# EAGLE design SchranklichtV3 (EAGLE 9.6.2)
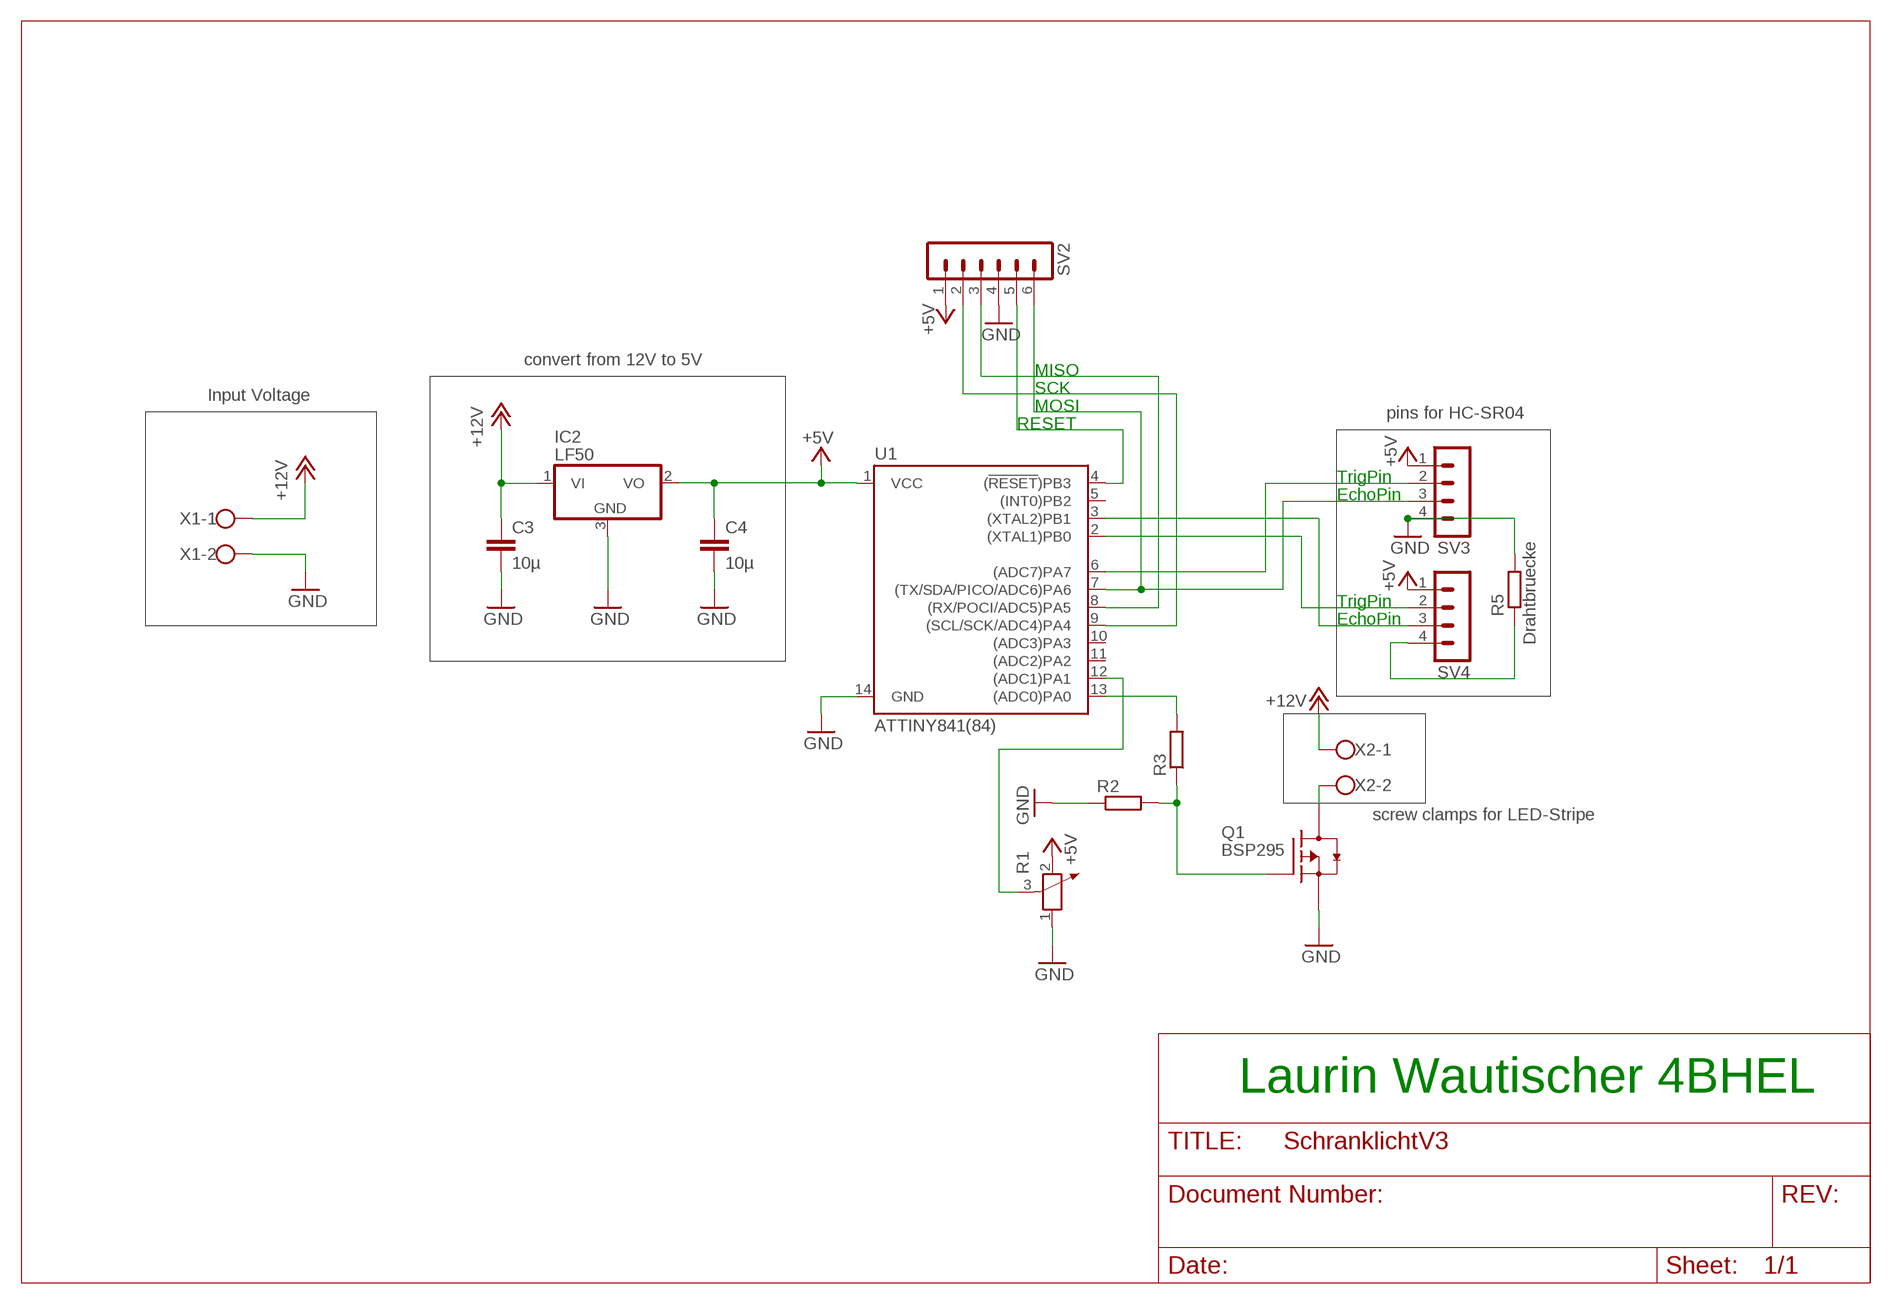
[diagram p0: schematic, sheet 1]

## Parts
C3  10µ  C-EUC1210  [C1210]
C4  10µ  C-EUC1210  [C1210]
IC2  LF50  7805DT  [TO252]
Q1  BSP295  MOSFET-PCH_SOT-223  [SOT230P700X160-4N]
R1  POTENTIOMETER_PT-10  [PT-10]
R2  R-EU_0207/10  [0207/10]
R3  R-EU_0207/10  [0207/10]
R5  Drahtbruecke  R-EU_0207/7  [0207/7]
SV2  MA06-1  [MA06-1]
SV3  MA04-1  [MA04-1]
SV4  MA04-1  [MA04-1]
U1  ATTINY841(84)  ATTINY84  [SO14]
X1  W237-102  [W237-102]
X2  W237-102  [W237-102]

## Nets
+5V: C4.1 IC2.2(VO) R1.2 SV2.1 SV3.1 SV4.1 U1.1(VCC)
+12V: C3.1 IC2.1(VI) X1.1 X2.1
GND: C3.2 C4.2 IC2.3(GND) Q1.3(S) R1.1 R2.1 R5.2 SV2.4 SV3.4 U1.14(GND) X1.2
N$1: SV2.5 U1.4((!RESET!)PB3)
N$2: SV2.6 SV3.3 U1.7((TX/SDA/PICO/ADC6)PA6)
N$3: SV3.2 U1.6((ADC7)PA7)
N$4: SV4.3 U1.3((XTAL2)PB1)
N$5: SV4.2 U1.2((XTAL1)PB0)
N$6: R1.3 U1.12((ADC1)PA1)
N$7: R3.2 U1.13((ADC0)PA0)
N$8: Q1.4(D) X2.2
N$9: Q1.1(G) R2.2 R3.1
N$10: R5.1 SV4.4
N$11: SV2.2 U1.9((SCL/SCK/ADC4)PA4)
N$12: SV2.3 U1.8((RX/POCI/ADC5)PA5)
Unconnected: U1.5((INT0)PB2) U1.10((ADC3)PA3) U1.11((ADC2)PA2)

## Notes on the sheet
- convert from 12V to 5V
- MISO
- SCK
- Input Voltage
- MOSI
- pins for HC-SR04
- RESET
- TrigPin
- EchoPin
- TrigPin
- EchoPin
- screw clamps for LED-Stripe
- Laurin Wautischer 4BHEL

## Library data of the parts
C3 C4 = rcl:C-EU: CAPACITOR, European symbol; SPICEPREFIX: C
IC2 = linear:78*: Positive VOLTAGE REGULATOR Source: http://cache.national.com/ds/LM/LM78L05.pdf http://www.fairchildsemi.com/ds/LM/LM7805.pdf; SPICEPREFIX: J
Q1 = ipc-7351-transistor:MOSFET-PCH_
R1 = rcl:POTENTIOMETER_: Potentiometer; SPICEMODEL: POT; SPICEPREFIX: X
R2 R3 R5 = rcl:R-EU_: RESISTOR, European symbol; SPICEPREFIX: R
SV2 = con-lstb:MA06-1: PIN HEADER; OC_FARNELL: unknown; OC_NEWARK: unknown
SV3 SV4 = con-lstb:MA04-1: PIN HEADER; OC_FARNELL: unknown; OC_NEWARK: unknown
U1 = SparkFun-IC-Microcontroller:ATTINY84: Atmel 14-pin 2/4/8kB flash uC Datasheet <https://cdn.sparkfun.com/datasheets/Widgets/doc8006.pdf> SparkFun Products Tiny AVR Programmer <https://www.sparkfun.com/products/11801> (PGM-11801) SparkFun Servo Trigger - Continuous Rotation <https://www.sparkfun.com/products/13872> (WIG-13872) SparkFun Servo Trigger <https://www.sparkfun.com/products/13118> (WIG-13118); PROD_ID: IC-11285; VALUE: ATTINY84
X1 X2 = con-wago-500:W237-102: WAGO SCREW CLAMP; MPN: 237-102; OC_FARNELL: unknown; OC_NEWARK: 70K9898

## Board
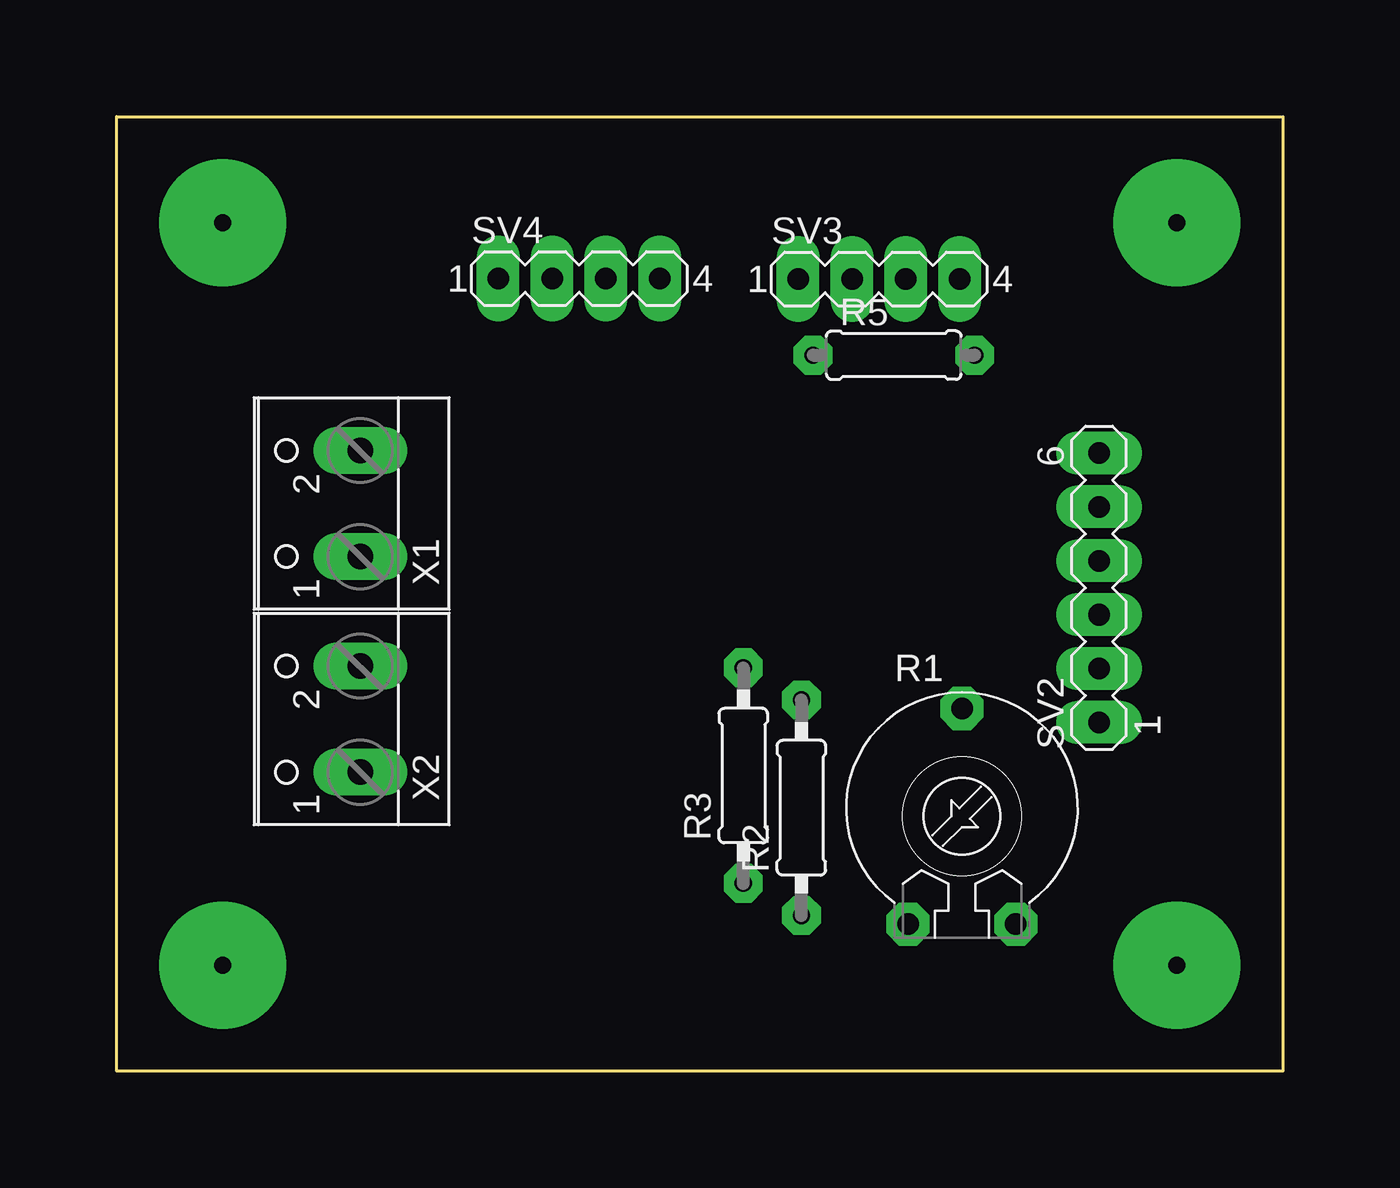
[diagram p1: board, top side]
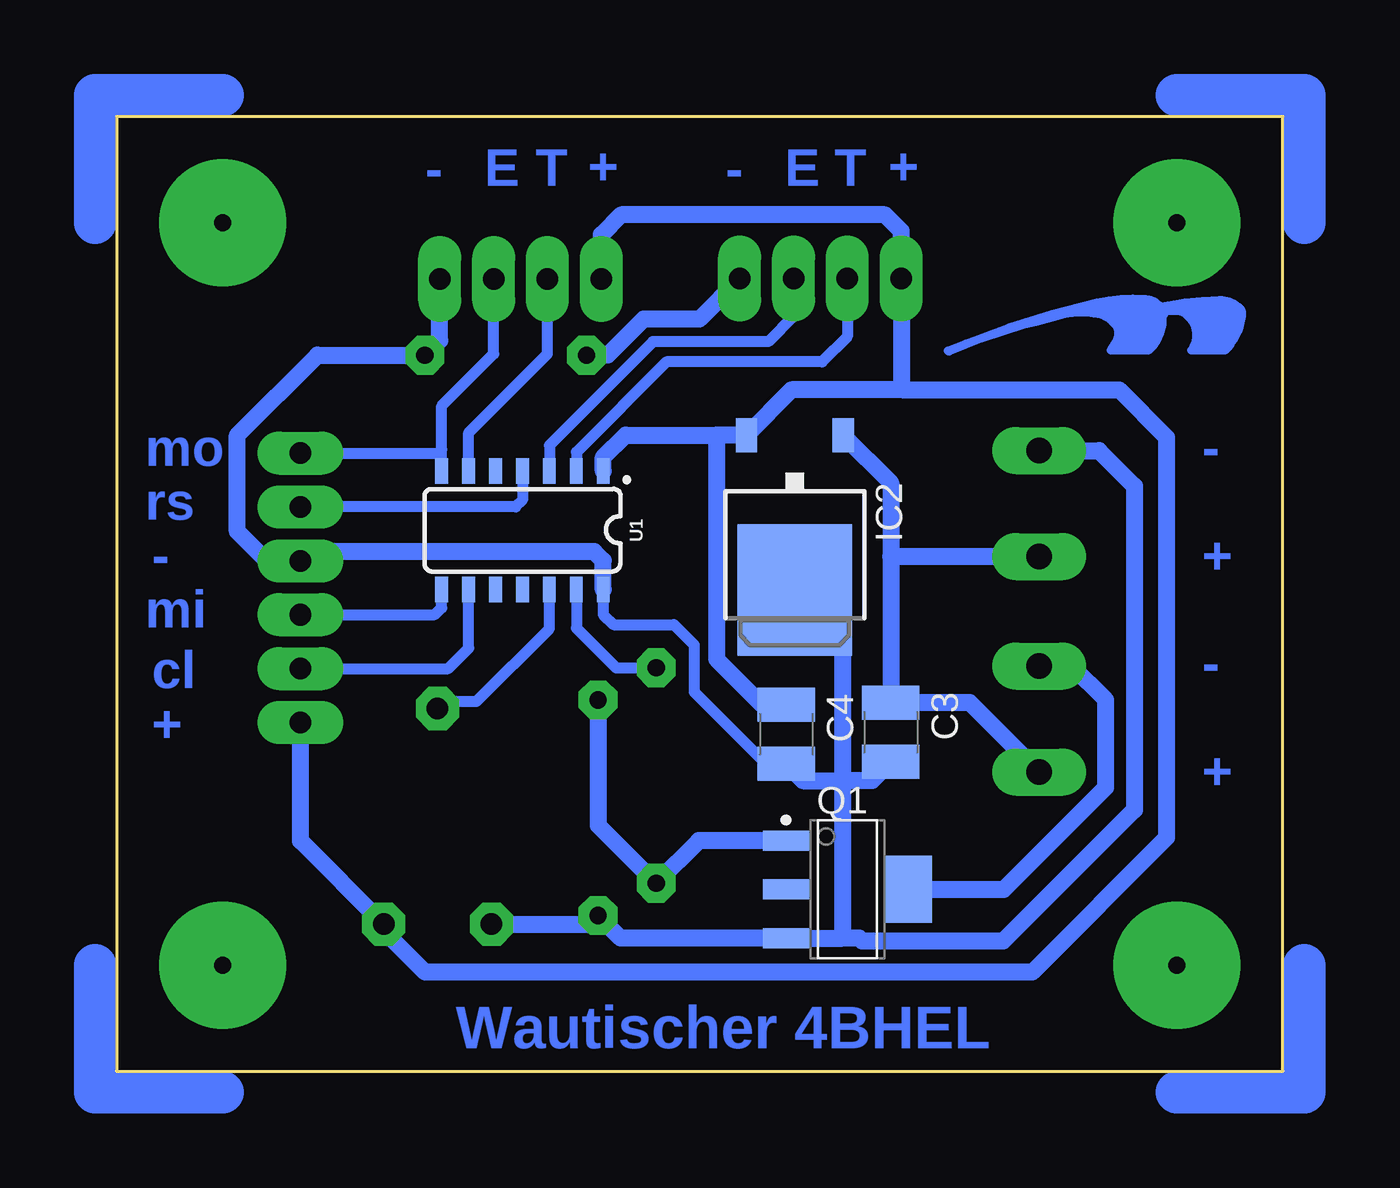
[diagram p2: board, bottom side, seen from below]

Size 55 x 45 mm. Coordinates in mm from the lower left corner, seen from the top.
Outline: 0,0 0,45 55,45 55,0 0,0
Copper layers (1*16): Top 0.035mm / dielectric 1.5mm / Bottom 0.035mm
Design rules "HTL-KLU-DRC *": minimum track width 16mil, minimum drill 31mil, track to track 16mil, track to pad 16mil, pad to pad 16mil, via to via 16mil, smd to smd 12mil, copper to edge 40mil, drill to drill 16mil, minimum pad ring 20mil, minimum via ring 16mil, stop-mask expansion 4mil, vias tented up to drill 0mil, thermal gap 20mil

### Footprints (pad centres in the part's own frame; a part is rotated, then mirrored left to right if it is on the bottom)
C1210 = smd 1.6 x 2.7: 1 -1.4,0; 2 1.4,0
TO252 = smd 1 x 1.6: 1 -2.28,-4.8; 2 2.28,-4.8 | smd 5.4 x 6.2: 3 0,2.5
SOT230P700X160-4N = smd 2.15 x 0.95: 1 -2.9,2.3; 2 -2.9,0; 3 -2.9,-2.3 | smd 2.15 x 3.15: 4 2.9,0
PT-10 = drill 1.016 pad 1.778 octagon: 1 -2.54,-5.08; 2 2.54,-5.08; 3 0,5.08
0207/10 = drill 0.813 octagon: 1 -5.08,0; 2 5.08,0
0207/7 = drill 0.813 octagon: 1 -3.81,0; 2 3.81,0
MA06-1 = drill 1.016 long: 1 -6.35,0; 2 -3.81,0; 3 -1.27,0; 4 1.27,0; 5 3.81,0; 6 6.35,0
MA04-1 = drill 1.016 long: 1 -3.81,0; 2 -1.27,0; 3 1.27,0; 4 3.81,0
SO14 = smd 0.6 x 1.2: 1 -3.81,-2.8; 2 -2.54,-2.8; 3 -1.27,-2.8; 4 0,-2.8; 5 1.27,-2.8; 6 2.54,-2.8; 7 3.81,-2.8; 8 3.81,2.8; 9 2.54,2.8; 10 1.27,2.8; 11 0,2.8; 12 -1.27,2.8; 13 -2.54,2.8; 14 -3.81,2.8
W237-102 = drill 1.194 long: 1 -2.5,-1.27; 2 2.5,-1.27

### Placement (x,y rotation side)
C3  18.49,15.98 270 bottom
C4  23.43,15.88 270 bottom
IC2  23.02,25.19 180 bottom
Q1  20.54,8.57 0 bottom
R1  39.87,12.02 0 top
R2  32.3,12.42 90 top
R3  29.55,13.94 90 top
R5  36.65,33.76 0 top
SV2  46.33,22.79 90 top
SV3  35.95,37.34 0 top
SV4  21.81,37.36 0 top
U1  35.86,25.5 180 bottom
U$1  [LOGOBOT_15]  7,34 0 top
X1  10.22,26.76 90 top
X2  10.22,16.6 90 top

### Tracks (layer width: path | path; a pad name or v marks a point on that pad's centre or on a via)
+5V
  Bottom 0.813: 17.88,32.12 23.18,32.12 IC2.2 26.7,29.99 | 17.88,32.12 7.71,32.12 5.49,29.89 5.49,11.01 11.82,4.67 40.45,4.67 42.41,6.62 R1.2 46.33,10.86 SV2.1 | SV3.1 32.14,39.44 31.21,40.37 18.76,40.37 18,39.61 SV4.1 18,32.24 17.88,32.12 | 26.7,29.99 26.7,19.42 24.56,17.29 C4.1 | 26.7,29.99 31,29.99 32.05,28.93 U1.1
+12V
  Bottom 0.813: X2.1 14.77,17.38 C3.1 18.49,24.26 | X1.1 18.49,24.26 | IC2.1 18.49,27.74 18.49,24.26
GND
  Bottom 0.508: U1.14 32.05,21.52 31.57,21.05 28.72,21.05 27.77,20.1 27.77,17.88 24.38,14.48 C4.2
  Bottom 0.813: R1.1 32.7,6.94 R2.1 31.23,6.27 Q1.3 20.78,6.27 | IC2.3 20.78,20.45 20.78,13.7 | 20.78,13.7 20.78,6.27 | C3.2 19.37,13.7 20.78,13.7 | C4.2 22.64,13.7 20.78,13.7 | U1.14 32.05,24.07 32.48,24.5 45.9,24.5 SV2.4 47.92,24.06 49.3,25.45 49.3,29.98 45.53,33.76 R5.2 39.76,34.45 SV3.4 | X1.2 8.67,29.26 6.99,27.58 6.99,12.33 13.18,6.14 19.84,6.14 19.97,6.27 20.78,6.27
N$1
  Bottom 0.508: U1.4 35.86,26.93 36.19,26.6 SV2.5
N$2
  Bottom 0.508: U1.7 39.67,29.3 | 39.67,29.3 39.67,31.37 37.22,33.82 SV3.3 | SV2.6 39.84,29.14 39.67,29.3
N$3
  Bottom 0.508: U1.6 38.4,30.1 34.68,33.82 SV3.2
N$4
  Bottom 0.508: SV4.3 23.08,35.58 24.27,34.39 29.7,34.39 34.59,29.5 U1.3
N$5
  Bottom 0.508: SV4.2 20.54,34.63 21.73,33.44 29.07,33.44 33.32,29.18 U1.2
N$6
  Bottom 0.508: R1.3 39.53,17.43 38.02,17.43 34.59,20.87 U1.12
N$7
  Bottom 0.508: U1.13 33.32,20.89 31.45,19.02 R3.2
N$8
  Bottom 0.813: Q1.4 13.16,8.57 8.35,13.38 8.35,17.51 9.94,19.1 X2.2
N$9
  Bottom 0.813: Q1.1 27.54,10.87 R3.1 32.3,11.6 R2.2
N$10
  Bottom 0.813: SV4.4 27.52,35.46 30.15,35.46 31.85,33.76 R5.1
N$11
  Bottom 0.508: SV2.2 39.36,18.98 38.4,19.94 U1.9
N$12
  Bottom 0.508: SV2.3 39.99,21.52 39.67,21.84 U1.8
N$13  (via drill 0.8 pad 6)
  other vias: 50,5
N$14  (via drill 0.8 pad 6)
  other vias: 50,40
N$15  (via drill 0.8 pad 6)
  other vias: 5,40
N$16  (via drill 0.8 pad 6)
  other vias: 5,5
N$17
  Bottom 2: -1,40 -1,46 5,46
N$18
  Bottom 2: 50,46 56,46 56,40
N$19
  Bottom 2: 56,5 56,-1 50,-1
N$20
  Bottom 2: 5,-1 -1,-1 -1,5

### Text on the board
Bottom: + | T | E | - | + | T | E | - | - | mo | rs | + | - | mi | - | cl | + | + | Wautischer 4BHEL